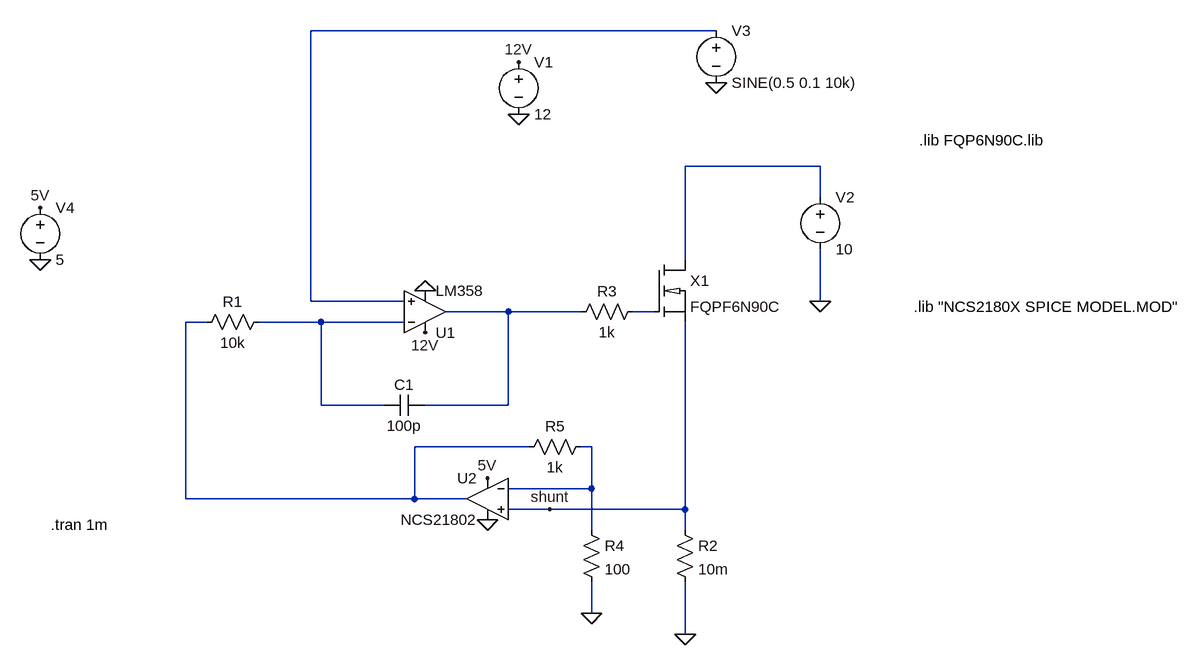
[diagram p0: schematic 12V_gate_drive.asc]
12V_gate_drive.asc, the LTspice schematic file:
Version 4
SHEET 1 1444 692
WIRE 720 -256 96 -256
WIRE 880 -48 672 -48
WIRE 880 0 880 -48
WIRE 672 96 672 -48
WIRE 96 160 96 -256
WIRE 240 160 96 160
WIRE 880 160 880 80
WIRE 400 176 304 176
WIRE 512 176 400 176
WIRE 624 176 592 176
WIRE -64 192 -96 192
WIRE 112 192 16 192
WIRE 240 192 112 192
WIRE 112 320 112 192
WIRE 208 320 112 320
WIRE 400 320 400 176
WIRE 400 320 272 320
WIRE 432 384 256 384
WIRE 528 384 512 384
WIRE 528 448 528 384
WIRE 528 448 400 448
WIRE -96 464 -96 192
WIRE 256 464 256 384
WIRE 256 464 -96 464
WIRE 336 464 256 464
WIRE 464 480 400 480
WIRE 672 480 672 192
WIRE 672 480 464 480
WIRE 528 512 528 448
WIRE 672 512 672 480
WIRE 528 640 528 592
WIRE 672 672 672 592
FLAG 272 144 0
FLAG 272 208 12V
FLAG 416 -208 12V
FLAG 416 -128 0
FLAG 672 672 0
FLAG 880 160 0
FLAG 464 480 shunt
FLAG 720 -176 0
FLAG 528 640 0
FLAG 368 496 0
FLAG -320 16 5V
FLAG -320 96 0
FLAG 368 432 5V
SYMBOL voltage 416 -224 R0
WINDOW 123 0 0 Left 0
WINDOW 39 0 0 Left 0
SYMATTR InstName V1
SYMATTR Value 12
SYMBOL res 32 176 R90
WINDOW 0 0 56 VBottom 2
WINDOW 3 32 56 VTop 2
SYMATTR InstName R1
SYMATTR Value 10k
SYMBOL cap 272 304 R90
WINDOW 0 0 32 VBottom 2
WINDOW 3 32 32 VTop 2
SYMATTR InstName C1
SYMATTR Value 100p
SYMBOL res 656 496 R0
SYMATTR InstName R2
SYMATTR Value 10m
SYMBOL voltage 880 -16 R0
WINDOW 123 0 0 Left 0
WINDOW 39 0 0 Left 0
SYMATTR InstName V2
SYMATTR Value 10
SYMBOL voltage 720 -272 R0
WINDOW 123 0 0 Left 0
WINDOW 39 0 0 Left 0
SYMATTR InstName V3
SYMATTR Value SINE(0.5 0.1 10k)
SYMBOL n_channel_mosfet 624 96 R0
SYMATTR InstName X1
SYMBOL res 608 160 R90
WINDOW 0 0 56 VBottom 2
WINDOW 3 32 56 VTop 2
SYMATTR InstName R3
SYMATTR Value 1k
SYMBOL ZZZ\\OpAmp\\LM358 272 176 M180
SYMATTR InstName U1
SYMBOL OpAmps\\opamp2 368 400 M0
SYMATTR InstName U2
SYMATTR Value NCS21802
SYMBOL res 512 496 R0
SYMATTR InstName R4
SYMATTR Value 100
SYMBOL res 528 368 R90
WINDOW 0 0 56 VBottom 2
WINDOW 3 32 56 VTop 2
SYMATTR InstName R5
SYMATTR Value 1k
SYMBOL voltage -320 0 R0
WINDOW 123 0 0 Left 0
WINDOW 39 0 0 Left 0
SYMATTR InstName V4
SYMATTR Value 5
TEXT -304 504 Left 2 !.tran 1m
TEXT 1032 -88 Left 2 !.lib FQP6N90C.lib
TEXT 1024 168 Left 2 !.lib "NCS2180X SPICE MODEL.MOD"

The netlist it stands for:
* 12V_gate_drive.asc
V1 12V 0 12
R1 N006 N005 10k
C1 N003 N006 100p
R2 shunt 0 10m
V2 N002 0 10
V3 N001 0 SINE(0.5 0.1 10k)
XX1 N002 N004 shunt FQPF6N90C  ; pins D G S
R3 N004 N003 1k
XU1 N001 N006 12V 0 N003 LM358  ; pins In+ In- V+ V- OUT
XU2 shunt N007 5V 0 N005 NCS21802  ; pins In+ In- V+ V- OUT
R4 N007 0 100
R5 N007 N005 1k
V4 5V 0 5
.tran 1m
.lib FQP6N90C.lib
.lib "NCS2180X SPICE MODEL.MOD"
.lib FQP6N90C.lib
.backanno
.end